# Altium schematic sheet STM32_microcontroller_RF.SchDoc: STM32 microcontroller RF
size A3; Date: Not used; ApprovedBy: Not used; CheckedBy: Not used; Author: Not used; CompanyName: STMicroelectronics; DrawnBy: Not used; Engineer: Not used; Organization: Not used; Address1: Not used; Address2: Not used; Address3: Not used; Address4: Not used; DocumentNumber: 5; Revision: Not used; SheetNumber: 5; SheetTotal: 8; CurrentTime: Not used; CurrentDate: Not used; Time: Not used; DocumentFullPathAndName: Not used; DocumentName: Not used; ModifiedDate: Not used; ImagePath: Not used; ProjectName: Not used; Application_BuildNumber: Not used
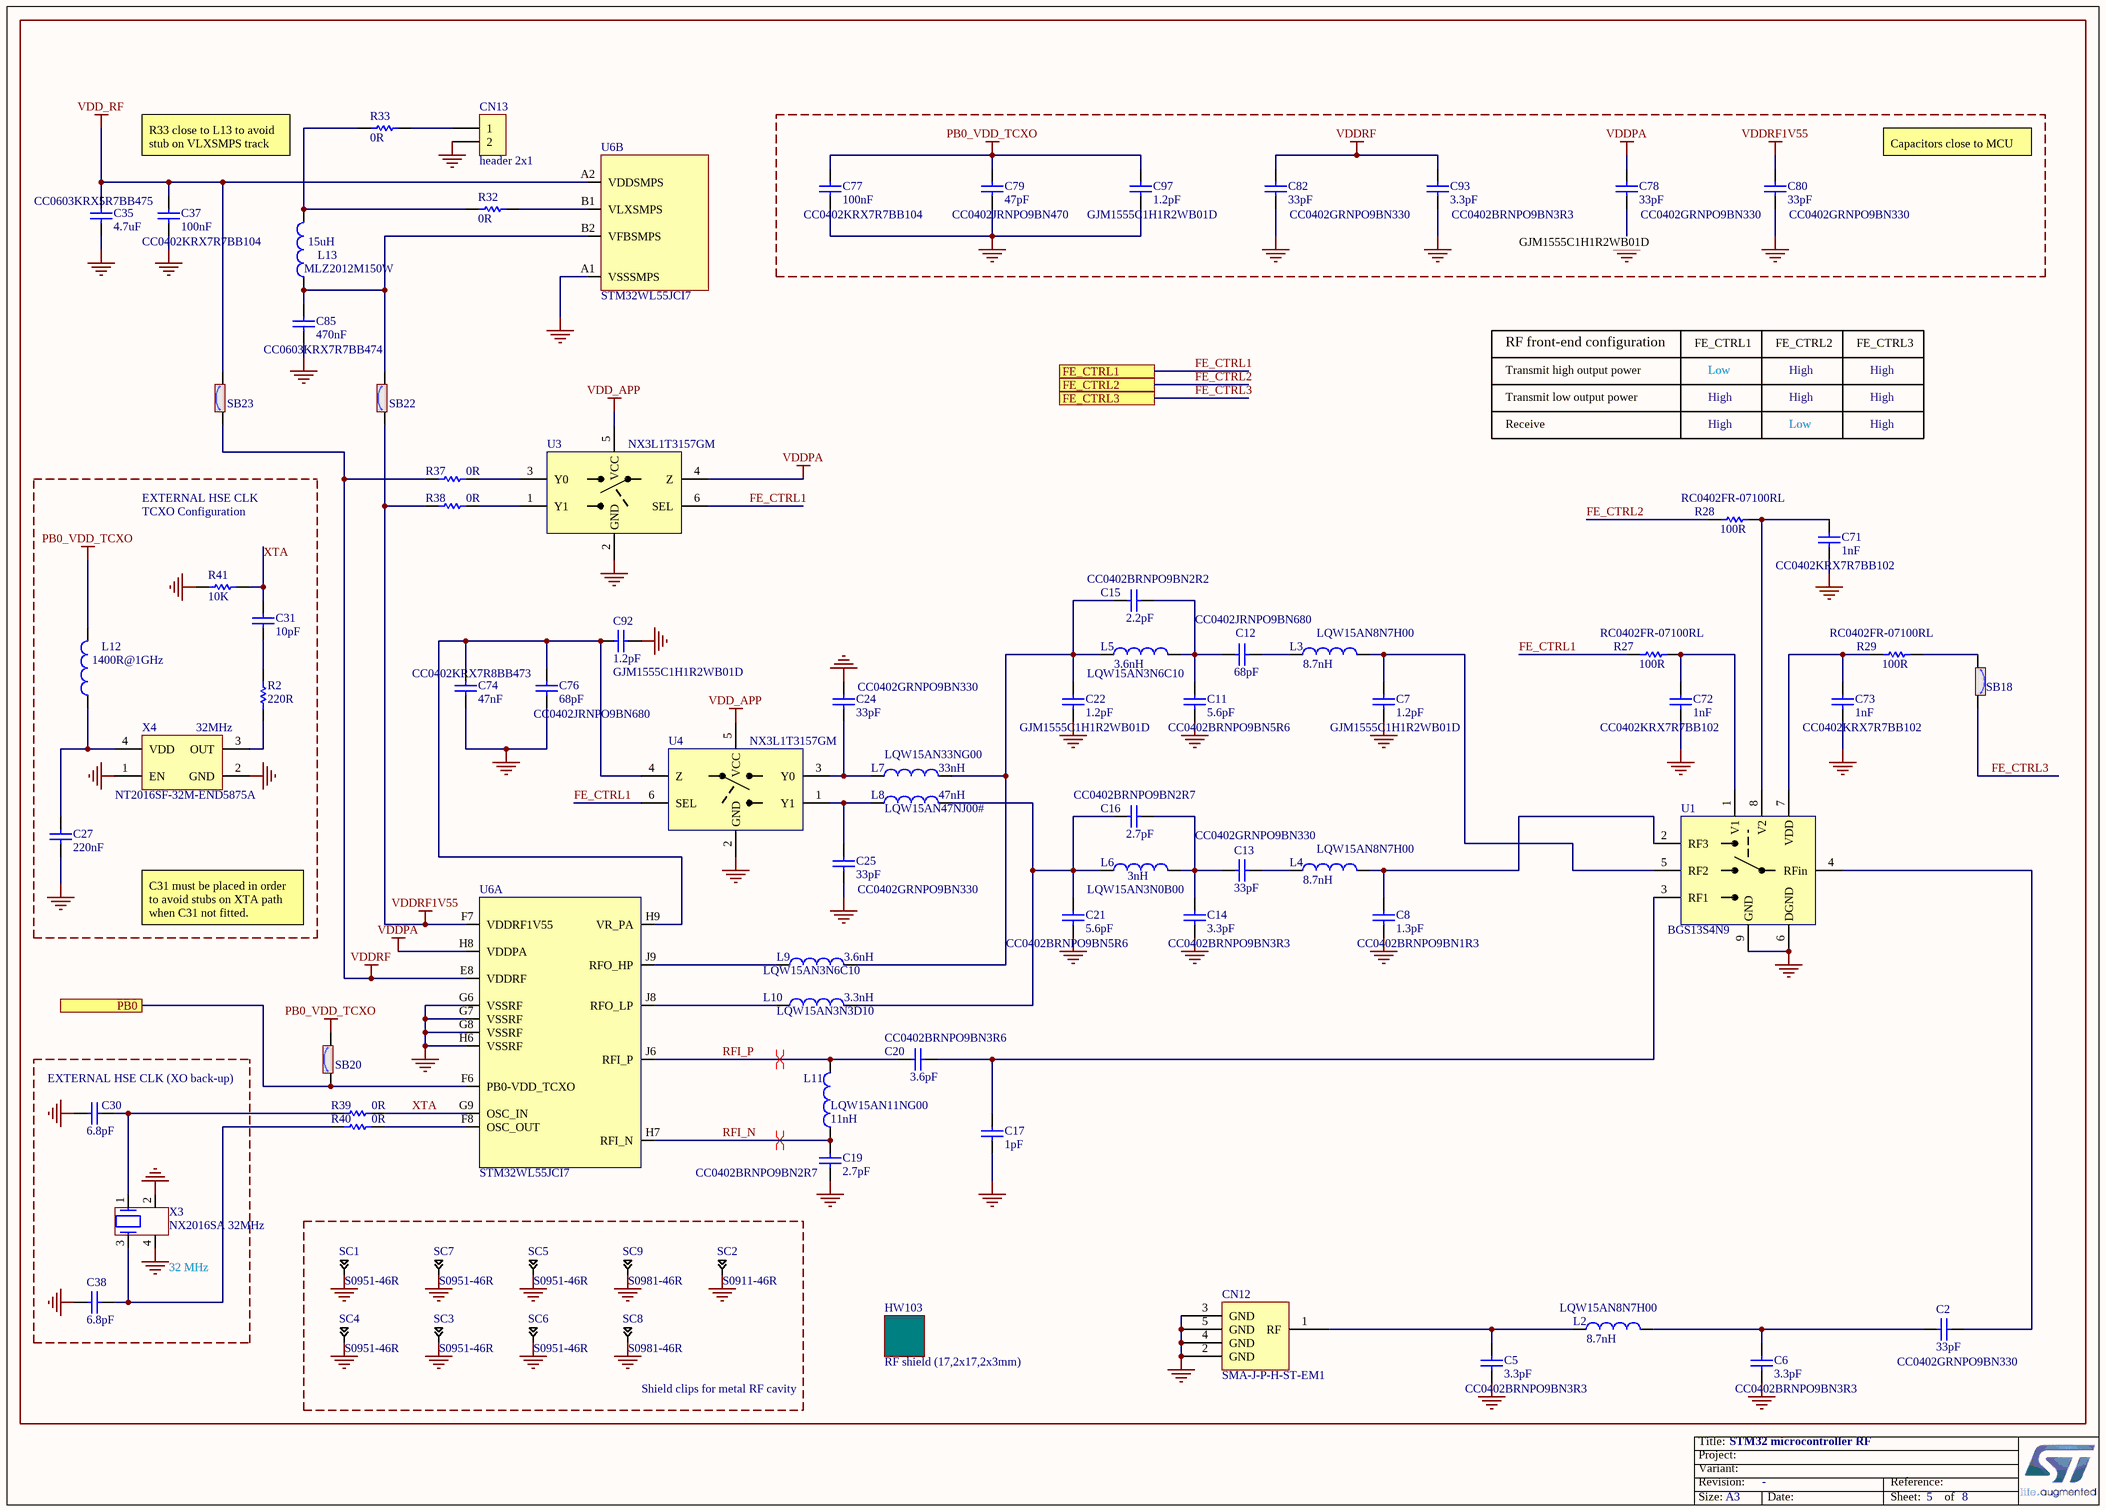
[diagram p0: STM32_microcontroller_RF.SchDoc]

## Parts
C2  value 33pF  Manufacturer_Part_Number: CC0402GRNPO9BN330  [C0402]
C5  value 3.3pF  Manufacturer_Part_Number: CC0402BRNPO9BN3R3  [C0402]
C6  value 3.3pF  Manufacturer_Part_Number: CC0402BRNPO9BN3R3  [C0402]
C7  value 1.2pF  Manufacturer_Part_Number: GJM1555C1H1R2WB01D  [C0402]  (hidden comment: Capacitor)
C8  value 1.3pF  Manufacturer_Part_Number: CC0402BRNPO9BN1R3  [C0402]
C11  value 5.6pF  Manufacturer_Part_Number: CC0402BRNPO9BN5R6  [C0402]  (hidden comment: Capacitor)
C12  value 68pF  Manufacturer_Part_Number: CC0402JRNPO9BN680  [C0402]  (hidden comment: Capacitor)
C13  value 33pF  Manufacturer_Part_Number: CC0402GRNPO9BN330  [C0402]
C14  value 3.3pF  Manufacturer_Part_Number: CC0402BRNPO9BN3R3  [C0402]
C15  value 2.2pF  Manufacturer_Part_Number: CC0402BRNPO9BN2R2  [C0402]  (hidden comment: Capacitor)
C16  value 2.7pF  Manufacturer_Part_Number: CC0402BRNPO9BN2R7  [C0402]
C17  value 1pF  [C0402]  (hidden comment: Capacitor)
C19  value 2.7pF  Manufacturer_Part_Number: CC0402BRNPO9BN2R7  [C0402]
C20  value 3.6pF  Manufacturer_Part_Number: CC0402BRNPO9BN3R6  [C0402]
C21  value 5.6pF  Manufacturer_Part_Number: CC0402BRNPO9BN5R6  [C0402]
C22  value 1.2pF  Manufacturer_Part_Number: GJM1555C1H1R2WB01D  [C0402]  (hidden comment: Capacitor)
C24  value 33pF  Manufacturer_Part_Number: CC0402GRNPO9BN330  [C0402]
C25  value 33pF  Manufacturer_Part_Number: CC0402GRNPO9BN330  [C0402]
C27  value 220nF  [C0402]  (hidden comment: Capacitor)
C30  value 6.8pF  [C0402]
C31  value 10pF  [C0402]  (hidden comment: Capacitor)
C35  value 4.7uF  Manufacturer_Part_Number: CC0603KRX5R7BB475  [C0603]
C37  value 100nF  Manufacturer_Part_Number: CC0402KRX7R7BB104  [C0402]
C38  value 6.8pF  [C0402]
C71  value 1nF  Manufacturer_Part_Number: CC0402KRX7R7BB102  [C0402]
C72  value 1nF  Manufacturer_Part_Number: CC0402KRX7R7BB102  [C0402]
C73  value 1nF  Manufacturer_Part_Number: CC0402KRX7R7BB102  [C0402]
C74  value 47nF  Manufacturer_Part_Number: CC0402KRX7R8BB473  [C0402]
C76  value 68pF  Manufacturer_Part_Number: CC0402JRNPO9BN680  [C0402]
C77  value 100nF  Manufacturer_Part_Number: CC0402KRX7R7BB104  [C0402]
C78  value 33pF  Manufacturer_Part_Number: CC0402GRNPO9BN330  [C0402]
C79  value 47pF  Manufacturer_Part_Number: CC0402JRNPO9BN470  [C0402]
C80  value 33pF  Manufacturer_Part_Number: CC0402GRNPO9BN330  [C0402]
C82  value 33pF  Manufacturer_Part_Number: CC0402GRNPO9BN330  [C0402]
C85  value 470nF  Manufacturer_Part_Number: CC0603KRX7R7BB474  [C0603]
C92  value 1.2pF  Manufacturer_Part_Number: GJM1555C1H1R2WB01D  [C0402]  (hidden comment: Capacitor)
C93  value 3.3pF  Manufacturer_Part_Number: CC0402BRNPO9BN3R3  [C0402]  (hidden comment: Capacitor)
C97  value 1.2pF  Manufacturer_Part_Number: GJM1555C1H1R2WB01D  [C0402]  (hidden comment: Capacitor)
CN12  value SMA-J-P-H-ST-EM1  [CON_SAMTEC_SMA-J-P-X-ST-EM1]
CN13  value header 2x1  [CON_988-JIUBABA_PHFS25-11-02-G0B115-T-1]
HW103  value RF shield (17,2x17,2x3mm)  [SHIELD_RF_ST-CUSTOM_17P2X17P2_H3]  (hidden comment: Daughter_Board)
L2  value 8.7nH  Manufacturer_Part_Number: LQW15AN8N7H00  [IND_0402_MURATA_LQW15AN_H0P5]
L3  value 8.7nH  Manufacturer_Part_Number: LQW15AN8N7H00  [IND_0402_MURATA_LQW15AN_H0P5]  (hidden comment: Inductor)
L4  value 8.7nH  Manufacturer_Part_Number: LQW15AN8N7H00  [IND_0402_MURATA_LQW15AN_H0P5]
L5  value 3.6nH  Manufacturer_Part_Number: LQW15AN3N6C10  [IND_0402_MURATA_LQW15AN_H0P5]  (hidden comment: Inductor)
L6  value 3nH  Manufacturer_Part_Number: LQW15AN3N0B00  [IND_0402_MURATA_LQW15AN_H0P5]  (hidden comment: Inductor)
L7  value 33nH  Manufacturer_Part_Number: LQW15AN33NG00  [IND_0402_MURATA_LQW15AN_H0P5]  (hidden comment: Inductor)
L8  value 47nH  Manufacturer_Part_Number: LQW15AN47NJ00#  [IND_0402_MURATA_LQW15AN2N4C00X]
L9  value 3.6nH  Manufacturer_Part_Number: LQW15AN3N6C10  [IND_0402_MURATA_LQW15AN_H0P5]
L10  value 3.3nH  Manufacturer_Part_Number: LQW15AN3N3D10  [IND_0402_MURATA_LQW15AN_H0P5]
L11  value 11nH  Manufacturer_Part_Number: LQW15AN11NG00  [IND_0402_MURATA_LQW15AN_H0P5]  (hidden comment: Inductor)
L12  value 1400R@1GHz  [IND_0402_MURATA_BLM15H_H0P5]
L13  value 15uH  Manufacturer_Part_Number: MLZ2012M150W  [IND_TDK_MLZ2012M150W]
R2  value 220R  [R0402]  (hidden comment: Resistor)
R27  value 100R  Manufacturer_Part_Number: RC0402FR-07100RL  [R0402]
R28  value 100R  Manufacturer_Part_Number: RC0402FR-07100RL  [R0402]
R29  value 100R  Manufacturer_Part_Number: RC0402FR-07100RL  [R0402]
R32  value 0R  [R0402]
R33  value 0R  [R0402]
R37  value 0R  [R0402]
R38  value 0R  [R0402]
R39  value 0R  [R0402]
R40  value 0R  [R0402]
R41  value 10K  [R0402]
SB18  (no value)  [SOLDER-BRIDGE_R0603-0R]
SB20  (no value)  [SOLDER-BRIDGE_R0603-0R]
SB22  (no value)  [SOLDER-BRIDGE_R0603-0R]
SB23  (no value)  [SOLDER-BRIDGE_R0603-0R]
SC1  value S0951-46R  [CLIP_HARWIN_S0951-46R]
SC2  value S0911-46R  (hidden comment: Shield-clip_S0951-46R)
SC3  value S0951-46R  [CLIP_HARWIN_S0951-46R]
SC4  value S0951-46R  [CLIP_HARWIN_S0951-46R]
SC5  value S0951-46R  [CLIP_HARWIN_S0951-46R]
SC6  value S0951-46R  [CLIP_HARWIN_S0951-46R]
SC7  value S0951-46R  [CLIP_HARWIN_S0951-46R]
SC8  value S0981-46R  (hidden comment: Shield-clip_S0981-46R)
SC9  value S0981-46R  (hidden comment: Shield-clip_S0981-46R)
U1  value BGS13S4N9  [ICC_TSNP-9-3_1P1X1P1_P040]
U3  value NX3L1T3157GM  [ICC_SOT886_XSON6]
U4  value NX3L1T3157GM  [ICC_SOT886_XSON6]
U6  value STM32WL55JCI7  [ICC_UFBGA73_5X5_P050]  (parts A,B of 5)
X3  value NX2016SA 32MHz  [CRY_NX2016SA_4P]
X4  value 32MHz  [CRY_NDK_NT2016SB_4P]  (hidden comment: NT2016SF)

## Blocks framed on the sheet
Shield clips for metal RF cavity: SC1-SC9

## Ports
FE_CTRL1, FE_CTRL2, FE_CTRL3, PB0

## Nets
GND: C5.1 C6.1 C7.1 C8.1 C11.1 C14.1 C17.1 C19.1 C21.1 C22.1 C24.2 C25.1 C27.1 C30.1 C35.1 C37.2 C38.1 C71.1 C72.1 C73.1 C74.1 C76.1 C77.2 C78.1 C79.1 C80.1 C82.1 C85.1 C92.1 C93.1 C97.1 CN12.2(GND) CN12.3(GND) CN12.4(GND) CN12.5(GND) CN13.2 R41.1 SC1.1 SC2.1 SC3.1 SC4.1 SC5.1 SC6.1 SC7.1 SC8.1 SC9.1 U1.6(DGND) U1.9(GND) U3.2(GND) U4.2(GND) U6.A1(VSSSMPS) U6.G6(VSSRF) U6.G7(VSSRF) U6.G8(VSSRF) U6.H6(VSSRF) X3.2 X3.4 X4.1(EN) X4.2(GND)
PB0_VDD_TCXO: C77.1 C79.2 C97.2 L12.2 SB20.2
VDD_APP: U3.5(VCC) U4.5(VCC)
VDD_RF: C35.2 C37.1 SB23.2 U6.A2(VDDSMPS)
VDDPA: C78.2 U3.4(Z) U6.H8(VDDPA)
VDDRF: C82.2 C93.2 R37.2 SB23.1 U6.E8(VDDRF)
VDDRF1V55: C80.2 R38.2 SB22.1 U6.F7(VDDRF1V55)
FE_CTRL1: R27.1 U3.6(SEL) U4.6(SEL) ; port FE_CTRL1
FE_CTRL2: R28.1 ; port FE_CTRL2
FE_CTRL3: SB18.2 ; port FE_CTRL3
PB0: SB20.1 U6.F6(PB0-VDD_TCXO) ; port PB0
RFI_N: C19.2 L11.1 U6.H7(RFI_N)
RFI_P: C20.1 L11.2 U6.J6(RFI_P)
XTA: C31.2 R39.1 R41.2 U6.G9(OSC_IN)
NetC2_1: C2.1 C6.2 L2.2
NetC2_2: C2.2 U1.4(RFin)
NetC5_2: C5.2 CN12.1(RF) L2.1
NetC7_2: C7.2 L3.2 U1.5(RF2)
NetC8_2: C8.2 L4.2 U1.2(RF3)
NetC11_2: C11.2 C12.1 C15.2 L5.2
NetC12_2: C12.2 L3.1
NetC13_1: C13.1 L4.1
NetC13_2: C13.2 C14.2 C16.1 L6.2
NetC15_1: C15.1 C22.2 L5.1 L7.2 L9.2
NetC16_2: C16.2 C21.2 L6.1 L8.2 L10.2
NetC17_2: C17.2 C20.2 U1.3(RF1)
NetC24_1: C24.1 L7.1 U4.3(Y0)
NetC25_2: C25.2 L8.1 U4.1(Y1)
NetC27_2: C27.2 L12.1 X4.4(VDD)
NetC30_2: C30.2 R39.2 X3.1
NetC31_1: C31.1 R2.2
NetC38_2: C38.2 R40.2 X3.3
NetC71_2: C71.2 R28.2 U1.8(V2)
NetC72_2: C72.2 R27.2 U1.1(V1)
NetC73_2: C73.2 R29.1 U1.7(VDD)
NetC74_2: C74.2 C76.2 C92.2 U4.4(Z) U6.H9(VR_PA)
NetC85_2: C85.2 L13.1 SB22.2 U6.B2(VFBSMPS)
NetCN13_1: CN13.1 R33.1
NetL9_1: L9.1 U6.J9(RFO_HP)
NetL10_1: L10.1 U6.J8(RFO_LP)
NetL13_2: L13.2 R32.2 R33.2
NetR2_1: R2.1 X4.3(OUT)
NetR29_2: R29.2 SB18.1
NetR32_1: R32.1 U6.B1(VLXSMPS)
NetR37_1: R37.1 U3.3(Y0)
NetR38_1: R38.1 U3.1(Y1)
NetR40_1: R40.1 U6.F8(OSC_OUT)

## Layout directives
differential pair: RFI_N, RFI_P

## Notes on the sheet
- R33 close to L13 to avoid stub on VLXSMPS track
- Capacitors close to MCU
- (near C78) GJM1555C1H1R2WB01D
- RF front-end configuration
- Transmit high output power
- FE_CTRL1
- Low
- FE_CTRL2
- High
- FE_CTRL3
- Transmit low output power
- Receive
- TCXO Configuration
- EXTERNAL HSE CLK
- C31 must be placed in order to avoid stubs on XTA path when C31 not fitted.
- (near C30) EXTERNAL HSE CLK (XO back-up)
- (near X3) 32 MHz
- Title:
- Project:
- Size:
- Revision:
- Variant:
- A3
- -
- Date:
- Reference:
- Sheet:
- of

## Library data of the parts
C2 C13 C24 C25 C78 C80 C82 = MCD-01784: Capacitor, MLCC, 33pF, 50V, NPO, +/-2%, 0402, T=0,5mm; Manufacturer: YAGEO; Provided_By: SUBCO; Internal_Part_Number: MCD-01784; Status: Checked; Part_Type: Capacitor; Package: C0402; ComponentLink1Description: Datasheet; ComponentLink1URL: http://tunmcdsvn.tun.st.com/Component_Datasheet_Library/Trunk/Capacitors/Yageo_Capacitor_NP0_16V-to-50V; ECCN_US: n/a; ECCN_EU: n/a
C5 C6 C14 = MCD-01775: Capacitor, MLCC, 3.3pF, 50V, NPO, +/-0.1pF, 0402, T=0,5mm; Manufacturer: YAGEO; Provided_By: SUBCO; Internal_Part_Number: MCD-01775; Status: Checked; Part_Type: Capacitor; Package: C0402; ComponentLink1Description: Datasheet; ComponentLink1URL: http://tunmcdsvn.tun.st.com/Component_Datasheet_Library/Trunk/Capacitors/Yageo_Capacitor_NP0_16V-to-50V; ECCN_US: n/a; ECCN_EU: n/a
C7 C22 C92 C97 = MCD-02065: Capacitor, High Q type for high frequency and high power, SMD, 1.2pF, 50V, 0,05pf, 0402; Part_Preference: Recommended; Manufacturer: MURATA; Order_Code_RS: 846-7246; Internal_Part_Number: MCD-02065; BMS_Part_Number: N/A; Status: Checked; Part_Type: Capacitor; Alternate_Manufacturer: N/A; Alternate_Manufacturer_Part_Number: N/A; Package: C0402; ComponentLink1Description: Datasheet; ComponentLink1URL: http://tunmcdsvn.tun.st.com/Component_Datasheet_Library/Trunk/Capacitors/MURATA_Chip_Monolithic_Ceramic_Capacitors; Order_Code_Digikey: 490-11195-2-ND; Order_Code_Farnell: 2781428
C8 = MCD-01772: Capacitor, MLCC, 1.3pF, 50V, NPO, +/-0.1pF, 0402, T=0,5mm; Manufacturer: YAGEO; Provided_By: SUBCO; Internal_Part_Number: MCD-01772; Status: Checked; Part_Type: Capacitor; Package: C0402; ComponentLink1Description: Datasheet; ComponentLink1URL: http://tunmcdsvn.tun.st.com/Component_Datasheet_Library/Trunk/Capacitors/Yageo_Capacitor_NP0_16V-to-50V; ECCN_US: n/a; ECCN_EU: n/a
C11 = MCD-01374: Capacitor, MLCC, 5.6pF, 50V, NPO, +/- 0.1pF, 0402, T=0,5mm; Part_Preference: Recommended; Manufacturer: YAGEO; Internal_Part_Number: MCD-01374; Status: Released; Part_Type: Capacitor; Package: C0402; ComponentLink1Description: Datasheet; ComponentLink1URL: http://tunmcdsvn.tun.st.com/Component_Datasheet_Library/Trunk/Capacitors/Yageo_Capacitor_NP0_16V-to-50V; Order_Code_Digikey: 311-1625-1-ND; Order_Code_Farnell: N/A; Order_Code_RS: N/A
C12 = MCD-01604: Capacitor, MLCC, 68pF, 50V, NPO, +/-5%, 0402, T=0,5mm; Part_Preference: Recommended; Manufacturer: YAGEO; Internal_Part_Number: MCD-01604; Status: Released; Part_Type: Capacitor; Package: C0402; ComponentLink1Description: Datasheet; ComponentLink1URL: http://tunmcdsvn.tun.st.com/Component_Datasheet_Library/Trunk/Capacitors/Yageo_Capacitor_NP0_16V-to-50V; Order_Code_Digikey: 311-1340-1-ND; Order_Code_Farnell: 3019214; Order_Code_RS: N/A
C15 = MCD-01773: Capacitor, MLCC, 2.2pF, 50V, NPO, +/-0.1pF, 0402, T=0,5mm; Part_Preference: Recommended; Manufacturer: YAGEO; Internal_Part_Number: MCD-01773; Status: Released; Part_Type: Capacitor; Package: C0402; ComponentLink1Description: Datasheet; ComponentLink1URL: http://tunmcdsvn.tun.st.com/Component_Datasheet_Library/Trunk/Capacitors/Yageo_Capacitor_NP0_16V-to-50V; Order_Code_Digikey: 311-1618-1-ND; Order_Code_Farnell: N/A; Order_Code_RS: N/A
C16 C19 = MCD-01774: Capacitor, MLCC, 2.7pF, 50V, NPO, +/-0.1pF, 0402, T=0,5mm; Manufacturer: YAGEO; Provided_By: SUBCO; Internal_Part_Number: MCD-01774; Status: Checked; Part_Type: Capacitor; Package: C0402; ComponentLink1Description: Datasheet; ComponentLink1URL: http://tunmcdsvn.tun.st.com/Component_Datasheet_Library/Trunk/Capacitors/Yageo_Capacitor_NP0_16V-to-50V; ECCN_US: n/a; ECCN_EU: n/a
C17 = MCD-01600: Capacitor, MLCC, 1pF, 50V, NPO, +/-0.1pF, 0402, T=0,5mm; Part_Preference: Recommended; Manufacturer: YAGEO; Manufacturer_Part_Number: CC0402BRNPO9BN1R0; Internal_Part_Number: MCD-01600; Status: Released; Part_Type: Capacitor; Package: C0402; ComponentLink1Description: Datasheet; ComponentLink1URL: http://tunmcdsvn.tun.st.com/Component_Datasheet_Library/Trunk/Capacitors/Yageo_Capacitor_NP0_16V-to-50V; Order_Code_Digikey: 311-3613-1-ND; Order_Code_Farnell: N/A; Order_Code_RS: N/A
C20 = MCD-01776: Capacitor, MLCC, 3.6pF, 50V, NPO, +/-0.1pF, 0402, T=0,5mm; Manufacturer: YAGEO; Provided_By: SUBCO; Internal_Part_Number: MCD-01776; Status: Checked; Part_Type: Capacitor; Package: C0402; ComponentLink1Description: Datasheet; ComponentLink1URL: http://tunmcdsvn.tun.st.com/Component_Datasheet_Library/Trunk/Capacitors/Yageo_Capacitor_NP0_16V-to-50V; ECCN_US: n/a; ECCN_EU: n/a
C21 = MCD-01374: Capacitor, MLCC, 5.6pF, 50V, NPO, +/- 0.1pF, 0402, T=0,5mm; Manufacturer: YAGEO; Provided_By: SUBCO; Internal_Part_Number: MCD-01374; Status: Released; Part_Type: Capacitor; Package: C0402; ComponentLink1Description: Datasheet; ComponentLink1URL: http://tunmcdsvn.tun.st.com/Component_Datasheet_Library/Trunk/Capacitors/Yageo_Capacitor_NP0_16V-to-50V; ECCN_US: N/A; ECCN_EU: N/A
C27 = MCD-00602: Capacitor, MLCC, 220nF, 16V, X7R, +/-10%, ,0402, T=0,5mm; Part_Preference: Recommended; Manufacturer: TDK; Manufacturer_Part_Number: C1005X7R1C224K050BE; Internal_Part_Number: MCD-00602; Status: Released; Part_Type: Capacitor; Package: C0402; ComponentLink1URL: http://tunmcdsvn.tun.st.com/Component_Datasheet_Library/Trunk/Capacitors/TDK_C1005X7R1C224K050BE/TDK_C1005X7R1C224K050BE.pdf; Order_Code_Digikey: 445-173638-1-ND; Order_Code_Farnell: N/A; Order_Code_RS: N/A
C30 C38 = MCD-00674: Capacitor, MLCC, 6.8pF, 50V, NPO, +-0.25pF, 0402, T=0.5mm; Manufacturer_Part_Number: CC0402CRNPO9BN6R8; Manufacturer: YAGEO; Provided_By: SUBCO; Internal_Part_Number: MCD-00674; Status: Released; Part_Type: Capacitor; Package: C0402; ComponentLink1Description: Datasheet; ComponentLink1URL: http://tunmcdsvn.tun.st.com/Component_Datasheet_Library/Trunk/Capacitors/Yageo_Capacitor_NP0_16V-to-50V; ECCN_US: N/A; ECCN_EU: N/A
C31 = MCD-00015: Capacitor, MLCC, 10pF, 50V, NPO, +/-5%, 0402, T=0,5mm; Part_Preference: Recommended; Manufacturer: YAGEO; Manufacturer_Part_Number: CC0402JRNPO9BN100; Internal_Part_Number: MCD-00015; Status: Released; Part_Type: Capacitor; Package: C0402; ComponentLink1Description: Datasheet; ComponentLink1URL: http://tunmcdsvn.tun.st.com/Component_Datasheet_Library/Trunk/Capacitors/Yageo_Capacitor_NP0_16V-to-50V
C35 = MCD-00009: Capacitor, MLCC, 4.7uF, 16V, X5R, 10%, 0603, T=0.8mm; Manufacturer: YAGEO; Provided_By: SUBCO; ECCN_US: EAR99; ECCN_EU: NEC; Internal_Part_Number: MCD-00009; ComponentLink1Description: Datasheet; Status: Released; Part_Type: Capacitor; Package: C0603; ComponentLink1URL: http://tunmcdsvn.tun.st.com/Component_Datasheet_Library/Trunk/Capacitors/Yageo_Multilayer_capacitor_X5R_series_100pF_to_100uF
C37 C77 = MCD-00102: Capacitor, MLCC, 100nF, 16V, X7R, 10%, 0402, T=0,5mm; Manufacturer: YAGEO; Alternate_Manufacturer_Part_Number: GCM155R71C104KA55D; Alternate_Manufacturer: MURATA; Provided_By: SUBCO; ECCN_US: EAR99; ECCN_EU: NEC; Internal_Part_Number: MCD-00102; Status: Released; Package: C0402; ComponentLink1Description: Datasheet; Part_Type: Capacitor; ComponentLink1URL: http://tunmcdsvn.tun.st.com/Component_Datasheet_Library/Trunk/Capacitors/Yageo_Multilayer_Capacitor_X7R_series_100pF_to_22uF
C71-C73 = MCD-00198: Capacitor, MLCC, 1nF, 16V, X7R, 10%, 0402, T=0.5mm; Manufacturer: YAGEO; Provided_By: SUBCO; ECCN_US: EAR99; ECCN_EU: NEC; Internal_Part_Number: MCD-00198; Status: Released; Part_Type: Capacitor; Package: C0402; ComponentLink1Description: Datasheet; ComponentLink1URL: http://tunmcdsvn.tun.st.com/Component_Datasheet_Library/Trunk/Capacitors/Yageo_Multilayer_Capacitor_X7R_series_100pF_to_22uF
C74 = MCD-01605: Capacitor, MLCC, 47nF, 25V, X7R, +-10%, 0402, T=0,5mm; Manufacturer: YAGEO; Provided_By: SUBCO; Internal_Part_Number: MCD-01605; Status: Footprint available; Part_Type: Capacitor; Package: C0402; ComponentLink1Description: Datasheet; ComponentLink1URL: http://tunmcdsvn.tun.st.com/Component_Datasheet_Library/Trunk/Capacitors/Yageo_Multilayer_Capacitor_X7R_series_100pF_to_22uF; ECCN_US: N/A; ECCN_EU: N/A
C76 = MCD-01604: Capacitor, MLCC, 68pF, 50V, NPO, +-5%, 0402, T=0,5mm; Manufacturer: YAGEO; Provided_By: SUBCO; Internal_Part_Number: MCD-01604; Status: Released; Part_Type: Capacitor; Package: C0402; ComponentLink1Description: Datasheet; ComponentLink1URL: http://tunmcdsvn.tun.st.com/Component_Datasheet_Library/Trunk/Capacitors/Yageo_Capacitor_NP0_16V-to-50V; ECCN_US: N/A; ECCN_EU: N/A
C79 = MCD-01603: Capacitor, MLCC, 147pF, 50V, NPO, +-5%, 0402, T=0,5mm; Manufacturer: YAGEO; Provided_By: SUBCO; Internal_Part_Number: MCD-01603; Status: Released; Part_Type: Capacitor; Package: C0402; ComponentLink1Description: Datasheet; ComponentLink1URL: http://tunmcdsvn.tun.st.com/Component_Datasheet_Library/Trunk/Capacitors/Yageo_Capacitor_NP0_16V-to-50V; ECCN_US: N/A; ECCN_EU: N/A
C85 = MCD-01006: Capacitor, MLCC, 470nF, 16V, X7R, 10%, 0603, T=0.8mm; Manufacturer: YAGEO; Provided_By: SUBCO; Internal_Part_Number: MCD-01006; Status: Released; Part_Type: Capacitor; Package: C0603; ComponentLink1Description: Datasheet; ComponentLink1URL: http://tunmcdsvn.tun.st.com/Component_Datasheet_Library/Trunk/Capacitors/Yageo_Multilayer_Capacitor_X7R_series_100pF_to_22uF/; ECCN_US: N/A; ECCN_EU: N/A
C93 = MCD-01775: Capacitor, MLCC, 3.3pF, 50V, NPO, +/-0.1pF, 0402, T=0,5mm; Part_Preference: Recommended; Manufacturer: YAGEO; Internal_Part_Number: MCD-01775; Status: Released; Part_Type: Capacitor; Package: C0402; ComponentLink1Description: Datasheet; ComponentLink1URL: http://tunmcdsvn.tun.st.com/Component_Datasheet_Library/Trunk/Capacitors/Yageo_Capacitor_NP0_16V-to-50V; Order_Code_Digikey: 311-1621-1-ND; Order_Code_Farnell: N/A; Order_Code_RS: N/A
CN12 = MCD-00279: RF SMA connector PCB edge; Manufacturer: SAMTEC; Provided_By: SUBCO; ECCN_US: EAR99; ECCN_EU: NEC; Internal_Part_Number: MCD-00279; Status: Released; Part_Type: Connector; Manufacturer_Part_Number: SMA-J-P-H-ST-EM1; ComponentLink1Description: Datasheet; ComponentLink1URL: http://tunmcdsvn.tun.st.com/Component_Datasheet_Library/Trunk/Connectors/Samtec_sma_SMA_series
CN13 = MCD-00314: Header, 2x1, 2.54mm, VR, TH, Height 6mm/3mm; Part_Type: Connector; Manufacturer_Part_Number: PHFS25-11-02-G0B115-T-1; Manufacturer: JIUBABA; Provided_By: SUBCO; Internal_Part_Number: MCD-00314; Status: Released; ComponentLink1Description: Datasheet; ComponentLink1URL: http://tunmcdsvn.tun.st.com/Component_Datasheet_Library/Trunk/Connectors/Jiubaba_PHFS25_11XXXXXXXXXX; ECCN_US: n/a; ECCN_EU: n/a
HW103 = MCD-02088: RF shield (17,2x17,2x3mm), Brass with Sn finishing, Sheet tickness : 0,2mm; BMS_Part_Number: TBD; Part_Preference: Recommended; Part_Type: Misc; Internal_Part_Number: MCD-02088; Status: Checked; Manufacturer: TBD; Manufacturer_Part_Number: RF shield (17,2x17,2x3mm); Alternate_Manufacturer: N/A; Alternate_Manufacturer_Part_Number: N/A; Package: N/A; ComponentLink1Description: Datasheet; ComponentLink1URL: http://tunmcdsvn.tun.st.com/Component_Datasheet_Library/Trunk/Misc/RF shielded box (17,2x17,2x3mm); Order_Code_Digikey: N/A; Order_Code_Farnell: N/A; Order_Code_RS: N/A
L2 L4 = MCD-01768: 0402 inductor, 8.7nH +/-3%, 540mA max, 0.14 ohm DC max, Q min = 25; Manufacturer: MURATA; Provided_By: SUBCO; Internal_Part_Number: MCD-01768; Status: Checked; Part_Type: Inductor; Package: L0402; ComponentLink1Description: Datasheet; ComponentLink1URL: http://tunmcdsvn.tun.st.com/Component_Datasheet_Library/Trunk/Inductors/Murata_inductor_LQW15ANseries; ECCN_US: n/a; ECCN_EU: n/a
L3 = MCD-01768: 0402 inductor, 8.7nH +/-3%, 540mA max, 0.14 ohm DC max, Q min = 25; Part_Preference: Recommended; Manufacturer: MURATA; Internal_Part_Number: MCD-01768; Status: Released; Part_Type: Inductor; Package: L0402; ComponentLink1Description: Datasheet; ComponentLink1URL: http://tunmcdsvn.tun.st.com/Component_Datasheet_Library/Trunk/Inductors/Murata_inductor_LQW15ANseries
L5 = MCD-01762: 0402 inductor, 3.6nH +/-0.2nH, 900mA max, 0.04 ohm DC max, Q min = 30; Part_Preference: Recommended; Manufacturer: MURATA; Internal_Part_Number: MCD-01762; Status: Released; Part_Type: Inductor; Package: L0402; ComponentLink1Description: Datasheet; ComponentLink1URL: http://tunmcdsvn.tun.st.com/Component_Datasheet_Library/Trunk/Inductors/Murata_inductor_LQW15ANseries
L6 = MCD-01922: 0402 inductor, 3nH +-0.1nH, 750mA max, 0.07 ohm DC max, Q min = 20; Manufacturer: MURATA; Provided_By: SUBCO; Internal_Part_Number: MCD-01922; Status: Footprint available; Part_Type: Inductor; Package: L0402; ComponentLink1Description: Datasheet; ComponentLink1URL: http://tunmcdsvn.tun.st.com/Component_Datasheet_Library/Trunk/Inductors/Murata_inductor_LQW15ANseries; ECCN_US: n/a; ECCN_EU: n/a
L7 = MCD-02069: Inductor, 33nH +/-2%, 260mA max , 0.63 ohm DC max, 0402, Q min = 25.; Part_Preference: Recommended; Manufacturer: MURATA; Order_Code_RS: 169-2777; Internal_Part_Number: MCD-02069; BMS_Part_Number: N/A; Status: Released; Part_Type: Inductor; Alternate_Manufacturer: N/A; Alternate_Manufacturer_Part_Number: N/A; Package: L0402; ComponentLink1Description: Datasheet; ComponentLink1URL: http://tunmcdsvn.tun.st.com/Component_Datasheet_Library/Trunk/Inductors/Murata_inductor_LQW15ANseries; Order_Code_Digikey: 490-6804-1-ND; Order_Code_Farnell: 1762626
L8 = MCD-01609: Inductor, 47nH, +-5%, 210mA, 1.08ohm DC max, 0402; Manufacturer: MURATA; Provided_By: SUBCO; Internal_Part_Number: MCD-01609; Status: Footprint available; Part_Type: Inductor; Package: L0402; ComponentLink1Description: Datasheet; ComponentLink1URL: http://tunmcdsvn.tun.st.com/Component_Datasheet_Library/Trunk/Inductors/Murata_inductor_LQW15ANseries/; ECCN_US: n/a; ECCN_EU: n/a
L9 = MCD-01762: 0402 inductor, 3.6nH +/-0.2nH, 900mA max, 0.04 ohm DC max, Q min = 30; Manufacturer: MURATA; Provided_By: SUBCO; Internal_Part_Number: MCD-01762; Status: Checked; Part_Type: Inductor; Package: L0402; ComponentLink1Description: Datasheet; ComponentLink1URL: http://tunmcdsvn.tun.st.com/Component_Datasheet_Library/Trunk/Inductors/Murata_inductor_LQW15ANseries; ECCN_US: n/a; ECCN_EU: n/a
L10 = MCD-01761: 0402 inductor, 3.3nH +-0.5nH, 900mA max, 0.04 ohm DC max, Q min = 30; Manufacturer: MURATA; Provided_By: SUBCO; Internal_Part_Number: MCD-01761; Status: Checked; Part_Type: Inductor; Package: L0402; ComponentLink1Description: Datasheet; ComponentLink1URL: http://tunmcdsvn.tun.st.com/Component_Datasheet_Library/Trunk/Inductors/Murata_inductor_LQW15ANseries; ECCN_US: n/a; ECCN_EU: n/a
L11 = MCD-01921: 0402 inductor, 11nH +-2%, 500mA max, 0.14 ohm DC max, Q min = 30; Manufacturer: MURATA; Provided_By: SUBCO; Internal_Part_Number: MCD-01921; Status: Footprint available; Part_Type: Inductor; Package: L0402; ComponentLink1Description: Datasheet; ComponentLink1URL: http://tunmcdsvn.tun.st.com/Component_Datasheet_Library/Trunk/Inductors/Murata_inductor_LQW15ANseries; ECCN_US: n/a; ECCN_EU: n/a
L12 = MCD-01610: ferrite bead, 1400ohms at 1GHz, 250mA, 1.1ohms DC max; Manufacturer_Part_Number: BLM15HG102SN1#; Manufacturer: MURATA; Provided_By: SUBCO; Internal_Part_Number: MCD-01610; Status: Footprint available; Part_Type: Inductor; Package: L0402; ComponentLink1Description: Datasheet; ComponentLink1URL: http://tunmcdsvn.tun.st.com/Component_Datasheet_Library/Trunk/Inductors/Murata_ferrite-bead_BLM15series; ECCN_US: n/a; ECCN_EU: n/a
L13 = MCD-01433: MLZ2012 Multilayer Shielded Inductor 15uH, +/-5%; Manufacturer: TDK; Provided_By: SUBCO; Internal_Part_Number: MCD-01433; Status: Checked; Part_Type: Inductor; Package: L0805; ComponentLink1Description: Datasheet; ComponentLink1URL: http://tunmcdsvn.tun.st.com/Component_Datasheet_Library/Trunk/Inductors/TDK_Inductor_MLZ2012%20series/; ECCN_US: n/a; ECCN_EU: n/a
R2 = MCD-00427: Resistor,220R,0402,1%,1/16W; Manufacturer_Part_Number: RC0402FR-07220RL; Manufacturer: YAGEO; ECCN_US: EAR99; ECCN_EU: NEC; Provided_By: SUBCO; Internal_Part_Number: MCD-00427; Status: Released; Part_Type: Resistor; Package: R0402; ComponentLink1Description: Datasheet; ComponentLink1URL: http://tunmcdsvn.tun.st.com/Component_Datasheet_Library/Trunk/Resistors/Yageo_Resistor_RC0402-series
R27-R29 = MCD-00119: Resistor,100R,0402,1%,1/16W; Manufacturer: YAGEO; Provided_By: SUBCO; ECCN_US: EAR99; ECCN_EU: NEC; Internal_Part_Number: MCD-00119; Status: Released; Part_Type: Resistor; Package: R0402; ComponentLink1Description: Datasheet; ComponentLink1URL: http://tunmcdsvn.tun.st.com/Component_Datasheet_Library/Trunk/Resistors/Yageo_Resistor_RC0402-series
R32 R33 R37-R40 = MCD-00052: Resistor,0R,0402,5%,1/16W; Manufacturer_Part_Number: RC0402JR-070RL; Manufacturer: YAGEO; Provided_By: SUBCO; ECCN_US: EAR99; ECCN_EU: NEC; Internal_Part_Number: MCD-00052; Status: Released; Part_Type: Resistor; Package: R0402; ComponentLink1Description: Datasheet; ComponentLink1URL: http://tunmcdsvn.tun.st.com/Component_Datasheet_Library/Trunk/Resistors/Yageo_Resistor_RC0402-series
R41 = MCD-00053: Resistor,10K,0402,1%,1/16W; Manufacturer_Part_Number: RC0402FR-0710KL; Manufacturer: YAGEO; BMS_Part_Number: 9131590; ECCN_US: EAR99; ECCN_EU: NEC; Provided_By: SUBCO; Internal_Part_Number: MCD-00053; Status: Released; Part_Type: Resistor; Package: R0402; ComponentLink1Description: Datasheet; ComponentLink1URL: http://tunmcdsvn.tun.st.com/Component_Datasheet_Library/Trunk/Resistors/Yageo_Resistor_RC0402-series
SB18 SB20 SB22 SB23 = MCD-00071: Solder Bridge ON; Part_Type: Mechanical; Manufacturer_Part_Number: RC0603JR-070RL; Manufacturer: YAGEO; Provided_By: SUBCO; Internal_Part_Number: MCD-00071; Status: Released; Package: SB0603; ComponentLink1Description: Datasheet; ComponentLink1URL: http://tunmcdsvn.tun.st.com/Component_Datasheet_Library/Trunk/Resistors/Yageo_Resistor_RC0603-series; ECCN_US: n/a; ECCN_EU: n/a
SC1 SC3-SC7 = MCD-01587: shield clip Harwin S0951-46R to fix RF shielded cavity; Part_Type: Connector; ECCN_US: tbd; Provided_By: SUBCO; Internal_Part_Number: MCD-01587; Status: Footprint available; Manufacturer_Part_Number: S0951-46R; Manufacturer: HARWIN; Package: na; ComponentLink1Description: Datasheet; ComponentLink1URL: http://tunmcdsvn.tun.st.com/Component_Datasheet_Library/Trunk/Connectors/Harwin_Shield-clip_S0951-46R; ECCN_EU: tbd
SC2 = MCD-02165: shield clip Harwin S0911-46R to fix RF shielded cavity - SMT RFI Shield Clip, Compact (T+R); Part_Type: Misc; Provided_By: SUBCO; PCB_Footprint_Ref1: CLIP_HARWIN_S0911-46R; Internal_Part_Number: MCD-02165; Status: Checked; Manufacturer_Part_Number: S0911-46R; Manufacturer: HARWIN; Alternate_Manufacturer_Part_Number: N/A; Alternate_Manufacturer: N/A; ComponentLink1Description: Datasheet; ComponentLink1URL: http://tunmcdsvn.tun.st.com/Component_Datasheet_Library/Trunk/Connectors/Harwin_Shield-clip_S0911-46R; Order_Code_Digikey: 952-4312-1-ND; Order_Code_Farnell: 3104143; Order_Code_RS: N/A
SC8 SC9 = MCD-02164: shield clip Harwin S0981-46R to fix RF shielded cavity - SMT RFI Shield Clip, Corner (T+R); Part_Type: Misc; Order_Code_RS: 161-3702; Provided_By: SUBCO; PCB_Footprint_Ref1: CLIP_HARWIN_S0981-46R; Internal_Part_Number: MCD-02164; Status: Checked; Manufacturer_Part_Number: S0981-46R; Manufacturer: HARWIN; Alternate_Manufacturer_Part_Number: N/A; Alternate_Manufacturer: N/A; ComponentLink1Description: Datasheet; ComponentLink1URL: http://tunmcdsvn.tun.st.com/Component_Datasheet_Library/Trunk/Connectors/Harwin_Shield-clip_S0981-46R; Order_Code_Digikey: 952-2518-1-ND; Order_Code_Farnell: 2361678
U1 = MCD-02018: Wideband RF SP3T Switch; Part_Type: IC; Manufacturer: INFINEON; ECCN_US: EAR99; ECCN_EU: tbd; Provided_By: SUBCO; Internal_Part_Number: MCD-02018; Status: Checked; Manufacturer_Part_Number: BGS13S4N9; Package: TSNP-9-3; ComponentLink1Description: Datasheet; ComponentLink1URL: http://tunmcdsvn.tun.st.com/Component_Datasheet_Library/Trunk/IC/Infineon_SP3T_BGS13S4N9/Infineon-BGS13S4N9-DS-v01_00-EN.pdf
U3 U4 = MCD-01514: DC switch - Ultra-Low 0.5ohm  SPDT analog switch; Part_Type: IC; Manufacturer: NXP; Provided_By: SUBCO; ECCN_US: EAR99; ECCN_EU: NEC; Internal_Part_Number: MCD-01514; Status: Footprint available; Manufacturer_Part_Number: NX3L1T3157GM; Package: SOT886; ComponentLink1Description: Datasheet; ComponentLink1URL: http://tunmcdsvn.tun.st.com/Component_Datasheet_Library/Trunk/IC/NXP_DCswitch_NX3L1T3157/
U6 = MCD-01435: Multiprotocol Wireless 32-bit MCUwith LPWAN Sub-GHz radio solution; Part_Type: IC; Manufacturer: STMICROELECTRONICS; ECCN_US: tbd; Internal_Part_Number: MCD-01435; Status: Footprint available; Manufacturer_Part_Number: STM32WL55JCI7; Package: UFBGA73; ComponentLink1Description: Datasheet; ComponentLink1URL: http://tunmcdsvn.tun.st.com/Component_Datasheet_Library/Trunk/IC/STM_STM32WL5x; Provided_By: n/a; ECCN_EU: tbd
X3 = MCD-01507: Crystal 32MHz, 10pF, +-10 ppm, 50ohm max, SMD; Part_Type: Crystal_Osc; Manufacturer_Part_Number: NX2016SA 32MHz EXS00A-CS06465; Manufacturer: NDK; Provided_By: SUBCO; ECCN_US: EAR99; ECCN_EU: NEC; Internal_Part_Number: MCD-01507; Status: Footprint available; Package: NX2016SA; ComponentLink1Description: Datasheet; ComponentLink1URL: http://tunmcdsvn.tun.st.com/Component_Datasheet_Library/Trunk/Crystal_Osc/NDK_NX2016SA 32MHz EXS00A-CS06465; Order_Code_Digikey: 644-1300
X4 = MCD-02240: NT2016SF-32M-END5875A; Part_Preference: Recommended; Part_Type: Crystal_Osc; Manufacturer: NDK; Internal_Part_Number: MCD-02240; Status: Checked; Manufacturer_Part_Number: NT2016SF-32M-END5875A; Alternate_Manufacturer: N/A; Alternate_Manufacturer_Part_Number: N/A; Package: 2016 size; ComponentLink1Description: Part_Information; ComponentLink1URL: http://tunmcdsvn.tun.st.com/Component_Datasheet_Library/Trunk/Crystal_Osc/NDK_NT2016SF%2032MHz%20END5875A%20(ETS10B-12472)/; Order_Code_Digikey: N/A; Order_Code_Farnell: N/A; Order_Code_RS: N/A